# Altium schematic sheet DS144-1.0-B溶解氧传感器.SchDoc
size A4
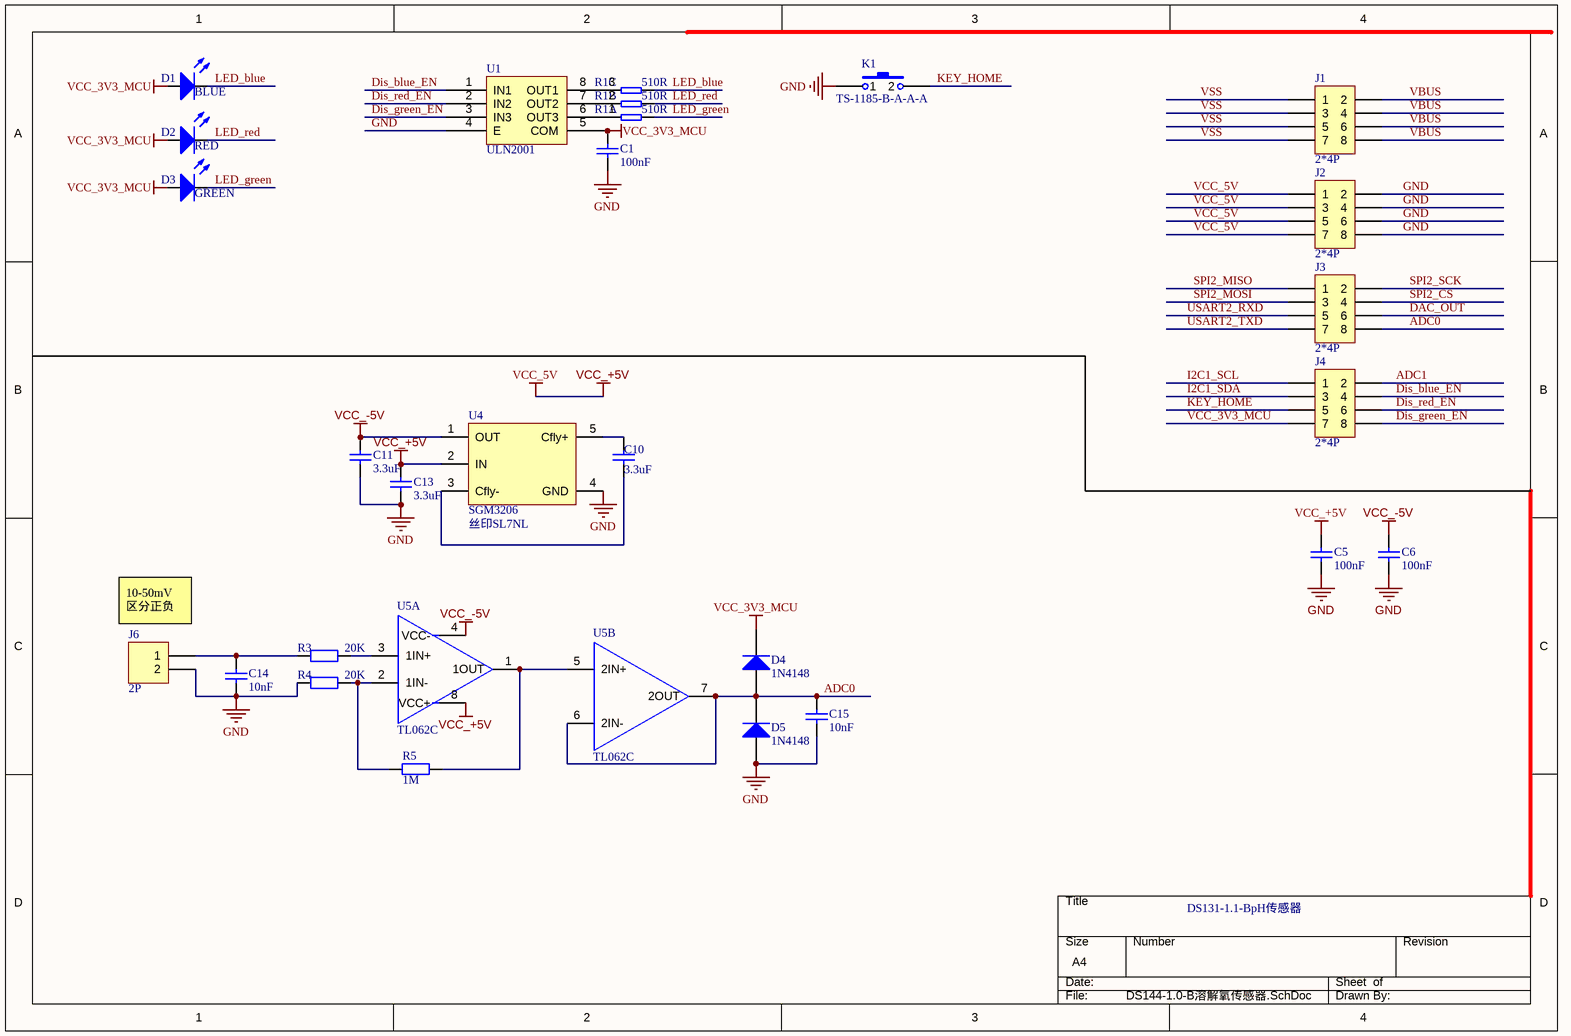
[diagram p0: DS144-1.0-B溶解氧传感器.SchDoc]

## Parts
C1  value 100nF  [0603CAP]  (hidden comment: SMDCAP00013)
C5  value 100nF  [0603CAP]  (hidden comment: SMDCAP00013)
C6  value 100nF  [0603CAP]  (hidden comment: SMDCAP00013)
C10  value 3.3uF  [0603CAP]  (hidden comment: SMDCAP00016)
C11  value 3.3uF  [0603CAP]  (hidden comment: SMDCAP00016)
C13  value 3.3uF  [0603CAP]  (hidden comment: SMDCAP00016)
C14  value 10nF  [0603CAP]  (hidden comment: SMDCAP00010)
C15  value 10nF  [0603CAP]  (hidden comment: SMDCAP00010)
D1  value BLUE  [LED_0805]  (hidden comment: SMDLED00010)
D2  value RED  [LED_0805]  (hidden comment: SMDLED00003)
D3  value GREEN  [LED_0805]  (hidden comment: Chip 翠绿LED 0805)
D4  value 1N4148  [SOD-123]  (hidden comment: DIPDIODE02001)
D5  value 1N4148  [SOD-123]  (hidden comment: DIPDIODE02001)
J1  value 2*4P  [X1321WVS-2x04J-C40D53]  (hidden comment: X1321WVS-2x04J-C40D53)
J2  value 2*4P  [X1321WVS-2x04J-C40D53]  (hidden comment: X1321WVS-2x04J-C40D53)
J3  value 2*4P  [X1321WVS-2x04J-C40D53]  (hidden comment: X1321WVS-2x04J-C40D53)
J4  value 2*4P  [X1321WVS-2x04J-C40D53]  (hidden comment: X1321WVS-2x04J-C40D53)
J6  value 2P  [SIP2]  (hidden comment: SL000000042)
K1  TS-1185-B-A-A-A  [KEY_TS-1185-x-A-A-A]
R1  value 510R  [0603RES_Pack4]  (hidden comment: SMDRES05003)  (parts A,B,C of 4)
R3  value 20K  [0603RES]  (hidden comment: SMDRES00058)
R4  value 20K  [0603RES]  (hidden comment: SMDRES00058)
R5  value 1M  [0603RES]  (hidden comment: SMDRES00085)
U1  value ULN2001  [SO-8]  (hidden comment: SMDIC000018)
U4  SGM3206  value 丝印SL7NL  [SOT23-5]
U5  TL062C  [SO-8]  (parts A,B of 2)

## Nets
GND: C1.1 C5.1 C6.1 C11.2 C13.2 C14.1 C15.1 D5.1(A) J2.2 J2.4 J2.6 J2.8 J6.2 K1.1 R4.1 U1.4(E) U4.4(GND)
VCC_3V3_MCU: C1.2 D1.1(A) D2.1(A) D3.1(A) D4.2(K) J4.7 U1.5(COM)
VCC_5V: C5.2 C13.1 J2.1 J2.3 J2.5 J2.7 U4.2(IN) U5.8(VCC+)  [also labelled VCC_+5V]
VCC_-5V: C6.2 C11.1 U4.1(OUT) U5.4(VCC-)
ADC0: C15.2 D4.1(A) D5.2(K) J3.8 U5.6(2IN-) U5.7(2OUT)
ADC1: J4.2
DAC_OUT: J3.6
Dis_blue_EN: J4.4 U1.1(IN1)
Dis_green_EN: J4.8 U1.3(IN3)
Dis_red_EN: J4.6 U1.2(IN2)
I2C1_SCL: J4.1
I2C1_SDA: J4.3
KEY_HOME: J4.5 K1.2
LED_blue: D1.2(K) R1.6
LED_green: D3.2(K) R1.8
LED_red: D2.2(K) R1.7
SPI2_CS: J3.4
SPI2_MISO: J3.1
SPI2_MOSI: J3.3
SPI2_SCK: J3.2
USART2_RXD: J3.5
USART2_TXD: J3.7
VBUS: J1.2 J1.4 J1.6 J1.8
VSS: J1.1 J1.3 J1.5 J1.7
NetC10_1: C10.1 U4.3(Cfly-)
NetC10_2: C10.2 U4.5(Cfly+)
NetC14_2: C14.2 J6.1 R3.2
NetR1_1: R1.1 U1.6(OUT3)
NetR1_2: R1.2 U1.7(OUT2)
NetR1_3: R1.3 U1.8(OUT1)
NetR3_1: R3.1 U5.3(1IN+)
NetR4_2: R4.2 R5.1 U5.2(1IN-)
NetR5_2: R5.2 U5.1(1OUT) U5.5(2IN+)

## Notes on the sheet
- (near J6) 10-50mV
  区分正负
- DS131-1.1-BpH传感器
- DWG. NO.
- REV.
- SHT.
- THIS DOCUMENT AND THE DATA DISCLOSED HEREIN OR HEREWITH IS THE PROPERTY OF ALTIUM LIMITED AND MAY BE FREELY DISTRIBUTED IN WHOLE. NO RIGHTS ARE RESERVED OR EXPRESS OR IMPLIED WARANTEE GIVEN.
- REVISION
- DESCRIPTION
- DATE
- APPROVED
- ENG:
- APPROVALS
- PROJECT
- DSN:
- CHK:
- REFERENCE DOCUMENTS
- PROJECT REVISION:
- TITLE
- DOCUMENT REVISION:
- DESIGN ITEM:
- BOM:
- FAB DWG:
- PCB DWG:
- ASSY DWG:
- SCALE:
- SIZE
- B
- CAGE CODE
- FILE NAME
- DWG NO.
- SHEET
- OF
- REV

## Library data of the parts
C1 C5 C6 = MLCC 100nF 50V ±10％ 0603: 贴片电容
C10 C11 C13 = MLCC 10uF 50V ±10％ 0603: 贴片电容
C14 C15 = MLCC 10nF 50V ±10％ 0603: 贴片电容
D1 = Chip 蓝色LED 0805: 贴片LED
D2 = Chip 红色LED 0805: 贴片LED
D3 = Chip 翠绿LED 0805: 贴片LED
D4 D5 = 1N4148W: 贴片开关二极管 T4
J1-J4 = X1321WVS-2x04J-C40D53: 双排针2x4P 立贴 1.27mm
J6 = DIP2 单排直针 1*40P 间距2.54mm 针长11mm 铜: 单排直针
K1 = TS-1185-B-A-A-A: 轻触开关; Value: TS-1185-B-A-A-A
R1 = Chip R*4 510R 1/16W ±5％ 0603: 贴片排阻
R3 R4 = Chip 20K 1/16W ±1％ 0603: 贴片电阻
R5 = Chip 1M 1/16W ±1％ 0603: 贴片电阻
U1 = ULN2001 SOP-8: 电机驱动芯片
U4 = SGM3206: 电荷泵芯片